# EAGLE design PSIO Switchboard PU-8 v1 (EAGLE 9.6.2)
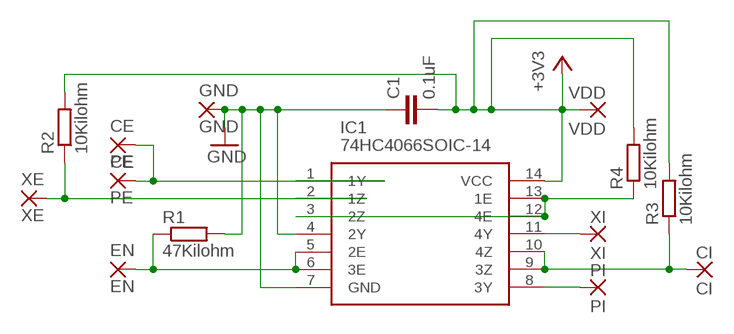
[diagram p0: schematic, sheet 1]

## Parts
C1  0.1uF  CAPACITORSC0805  [C0805]
CE  CE  PADSCIRCLE-2X2  [CIRCLE-2X2]
CI  CI  PADSCIRCLE-2X2  [CIRCLE-2X2]
EN  EN  PADSCIRCLE-2X2  [CIRCLE-2X2]
GND  GND  PADSCIRCLE-2X2  [CIRCLE-2X2]
IC1  74HC4066SOIC-14  [SOIC-14]
PE  PE  PADSCIRCLE-2X2  [CIRCLE-2X2]
PI  PI  PADSCIRCLE-2X2  [CIRCLE-2X2]
R1  47Kilohm  RESISTORSR0805  [R0805]
R2  10Kilohm  RESISTORSR0805  [R0805]
R3  10Kilohm  RESISTORSR0805  [R0805]
R4  10Kilohm  RESISTORSR0805  [R0805]
VDD  VDD  PADSCIRCLE-2X2  [CIRCLE-2X2]
XE  XE  PADSCIRCLE-2X2  [CIRCLE-2X2]
XI  XI  PADSCIRCLE-2X2  [CIRCLE-2X2]

## Nets
+3V3: C1.2 IC1.14(VCC) R2.2 R3.2 R4.2 VDD.1(P)
CI: CI.1(P) IC1.9(3Z) IC1.10(4Z) R3.1
EN: EN.1(P) IC1.5(2E) IC1.6(3E) R1.1
GND: C1.1 GND.1(P) IC1.4(2Y) IC1.7(GND) R1.2
N$1: IC1.3(2Z) IC1.12(4E) IC1.13(1E) R4.1
PE-CE: CE.1(P) IC1.1(1Y) PE.1(P)
PI: IC1.8(3Y) PI.1(P)
XE: IC1.2(1Z) R2.1 XE.1(P)
XI: IC1.11(4Y) XI.1(P)

## Library data of the parts
C1 = Consoles Unleashed Eagle Parts Library:CAPACITORS: Capacitors
CE CI EN GND PE PI VDD XE XI = Consoles Unleashed Eagle Parts Library:PADS: PADS to connect wires to PCB
IC1 = Consoles Unleashed Eagle Parts Library:74HC4066: 74HC4066 quad SPST analog switch.
R1-R4 = Consoles Unleashed Eagle Parts Library:RESISTORS: Resistors

## Board
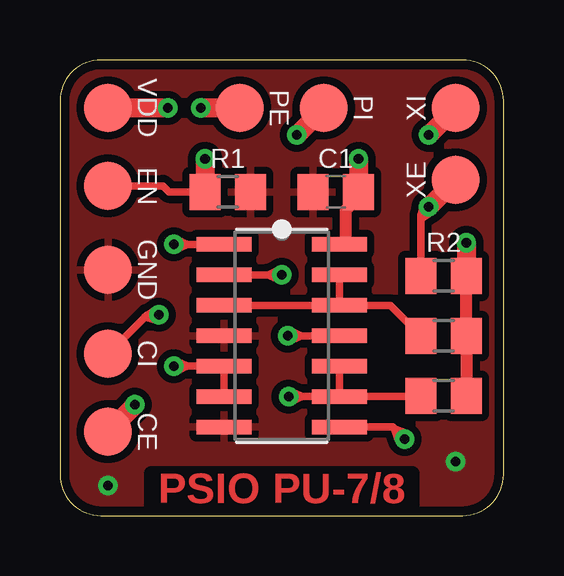
[diagram p1: board, top side]
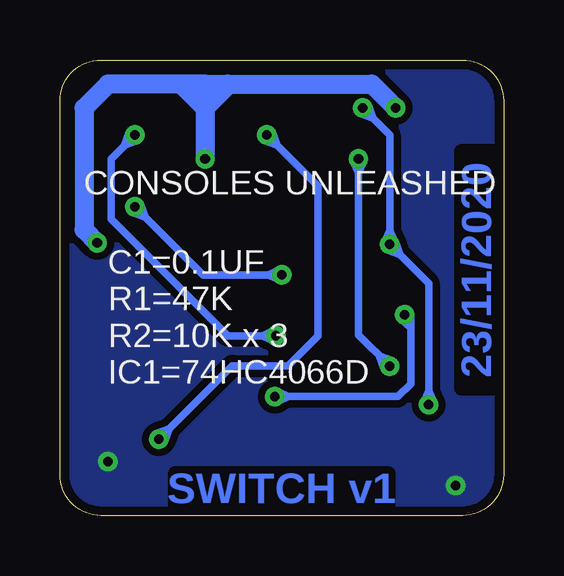
[diagram p2: board, bottom side, seen from below]

Size 18.5 x 19 mm. Coordinates in mm from the lower left corner, seen from the top.
Outline: 0,17.29 0,1.71 arc90 1.71,0 16.79,0 arc90 18.5,1.71 18.5,17.29 arc90 16.79,19 1.71,19 arc90 0,17.29
Copper layers (1*16): Top 0.035559375mm / dielectric 1.6mm / Bottom 0.035559375mm
Design rules "oshpark-2layer *": minimum track width 6mil, minimum drill 10mil, track to track 6mil, track to pad 6mil, pad to pad 6mil, via to via 6mil, smd to smd 6mil, copper to edge 15mil, drill to drill 6mil, minimum pad ring 5mil, minimum via ring 5mil, stop-mask expansion 2.5mil, vias tented up to drill 1mm, thermal gap 12mil

### Footprints (pad centres in the part's own frame; a part is rotated, then mirrored left to right if it is on the bottom)
C0805 = smd 1.3 x 1.5: 1 -0.95,0; 2 0.95,0
CIRCLE-2X2 = smd 2 x 2: 1 0,0
SOIC-14 = smd 2.286 x 0.61: 1 -2.413,3.81; 2 -2.413,2.54; 3 -2.413,1.27; 4 -2.413,0; 5 -2.413,-1.27; 6 -2.413,-2.54; 7 -2.413,-3.81; 8 2.413,-3.81; 9 2.413,-2.54; 10 2.413,-1.27; 11 2.413,0; 12 2.413,1.27; 13 2.413,2.54; 14 2.413,3.81
R0805 = smd 1.3 x 1.5: 1 -0.95,0; 2 0.95,0

### Placement (x,y rotation side)
C1  11.5,13.5 0 top
CE  2,3.5 0 top
CI  2,6.75 0 top
EN  2,13.75 0 top
GND  2,10.25 0 top
IC1  9.25,7.5 0 top
PE  7.5,17 0 top
PI  11,17 0 top
R1  7,13.5 0 top
R2  16,10 0 top
R3  16,5 0 top
R4  16,7.5 0 top
VDD  2,17 0 top
XE  16.5,14 0 top
XI  16.5,17 0 top

### Tracks (layer width: path | path; a pad name or v marks a point on that pad's centre or on a via)
+3V3  (via drill 0.4 pad 0.8)
  Top 0.508: R3.2 R4.2 R2.2 | IC1.14 11.91,11.31 11.91,12.71 12.45,13.25 C1.2 | v16.95,11.38 16.95,11.32
  Top 0.8: 16.95,11.32 R2.2 | v4.5,17 VDD.1 | v12.45,14.88 C1.2
  Bottom 0.8: 12.45,18 11.5,18 11.5,17.95 12.45,17 | 13.45,18 5.5,18 v4.5,17 | 12.45,18 12.45,17 | 12.45,17 v12.45,14.88 | 12.45,18 13.45,18 | 13.45,18 16.5,18 17.5,17 17.5,11.93 v16.95,11.38 | 12.45,17 13.45,18
CI  (via drill 0.4 pad 0.8)
  Top 0.305: IC1.9 v9.54,4.96 | IC1.9 IC1.10 | R3.1 15.01,4.96 IC1.9 | v4.12,8.38 3.62,8.38 CI.1 | v9.54,4.96 9.64,5.19 10.14,4.96 9.64,4.73 v9.54,4.96 | v4.12,8.38 4.06,8.14 3.53,8.28 3.99,8.58 v4.12,8.38
  Bottom 0.305: v9.54,4.96 4.42,4.96 3.88,5.5 3.88,8.38 v4.12,8.38 | v9.54,4.96 9.44,4.73 8.94,4.96 9.44,5.19 v9.54,4.96 | v4.12,8.38 4.29,8.19 3.88,7.83 3.88,8.38 v4.12,8.38
EN  (via drill 0.4 pad 0.8)
  Top 0.305: IC1.6 IC1.5 v4.75,6.23 | EN.1 4.3,13.75 4.55,13.5 R1.1 | v4.75,6.23 4.85,6.46 5.35,6.23 4.85,6 v4.75,6.23
  Top 0.8: v6.05,14.88 R1.1
  Bottom 0.305: v4.75,6.23 6.05,7.53 v6.05,14.88 | v4.75,6.23 4.66,6.46 5.17,6.65 4.98,6.14 v4.75,6.23 | v6.05,14.88 6.28,14.77 6.05,14.28 5.82,14.77 v6.05,14.88
GND  (via drill 0.4 pad 0.8)
  Top 0.305: IC1.7 5.94,3.69
  other vias: 16.5,2.25 2,1.25
  pour Bottom (isolate 0.305): 1.71,19 16.79,19 arc-90 18.5,17.29 18.5,1.71 arc-90 16.79,0 1.71,0 arc-90 0,1.71 0,17.29 arc-90
  pour Top (isolate 0.305): 1.71,19 16.79,19 arc-90 18.5,17.29 18.5,1.71 arc-90 16.79,0 1.71,0 arc-90 0,1.71 0,17.29 arc-90
N$1
  Top 0.305: IC1.3 IC1.12 | IC1.12 IC1.13 | R4.1 13.78,8.77 IC1.12
PE-CE  (via drill 0.4 pad 0.8)
  Top 0.305: IC1.1 v4.75,11.31 | v4.75,11.31 4.85,11.54 5.35,11.31 4.85,11.08 v4.75,11.31
  Top 0.8: PE.1 v5.88,17 | v3.12,4.62 CE.1
  Bottom 0.305: v4.75,11.31 3.12,9.69 v3.12,4.62 | v5.88,17 4.75,15.88 v4.75,11.31 | v4.75,11.31 4.84,11.08 4.33,10.89 4.52,11.4 v4.75,11.31 | v4.75,11.31 4.52,11.41 4.75,11.91 4.98,11.41 v4.75,11.31 | v3.12,4.62 2.9,4.73 3.12,5.22 3.35,4.73 v3.12,4.62 | v5.88,17 5.96,16.77 5.45,16.58 5.64,17.09 v5.88,17
PI  (via drill 0.4 pad 0.8)
  Top 0.305: v14.38,3.19 13.88,3.69 IC1.8 | v14.38,3.19 14.14,3.1 13.95,3.61 14.46,3.42 v14.38,3.19
  Top 0.8: PI.1 v9.88,15.88
  Bottom 0.305: v14.38,3.19 11.31,6.25 9,6.25 7.75,7.5 7.75,13.75 v9.88,15.88 | v9.88,15.88 9.96,15.64 9.45,15.45 9.64,15.96 v9.88,15.88 | v14.38,3.19 14.14,3.1 13.95,3.61 14.46,3.42 v14.38,3.19
XE  (via drill 0.4 pad 0.8)
  Top 0.305: IC1.2 v9.25,10.04 | R2.1 15.05,12.55 v15.38,12.88 | v9.25,10.04 9.15,9.81 8.65,10.04 9.15,10.27 v9.25,10.04 | v15.38,12.88 15.51,12.67 15.05,12.37 15.13,12.91 v15.38,12.88
  Top 0.8: XE.1 v15.38,12.88
  Bottom 0.305: v15.38,12.88 12.54,10.04 v9.25,10.04 | v9.25,10.04 9.35,10.27 9.85,10.04 9.35,9.81 v9.25,10.04 | v15.38,12.88 15.46,12.64 14.95,12.45 15.14,12.96 v15.38,12.88
XI  (via drill 0.4 pad 0.8)
  Top 0.305: IC1.11 v9.5,7.5 | v9.5,7.5 9.6,7.73 10.1,7.5 9.6,7.27 v9.5,7.5
  Top 0.8: XI.1 v15.38,15.88
  Bottom 0.305: v15.38,15.88 16.38,14.88 16.38,12.38 11.5,7.5 v9.5,7.5 | v15.38,15.88 15.61,15.96 15.8,15.45 15.29,15.64 v15.38,15.88 | v9.5,7.5 9.6,7.73 10.1,7.5 9.6,7.27 v9.5,7.5

### Text on the board
Top: PSIO PU-7/8
Bottom: 23/11/2020 | SWITCH v1
bNames: CONSOLES UNLEASHED | C1=0.1UF / R1=47K / R2=10K x 3 / IC1=74HC4066D